# EAGLE design tiny-usb (EAGLE 5.10)
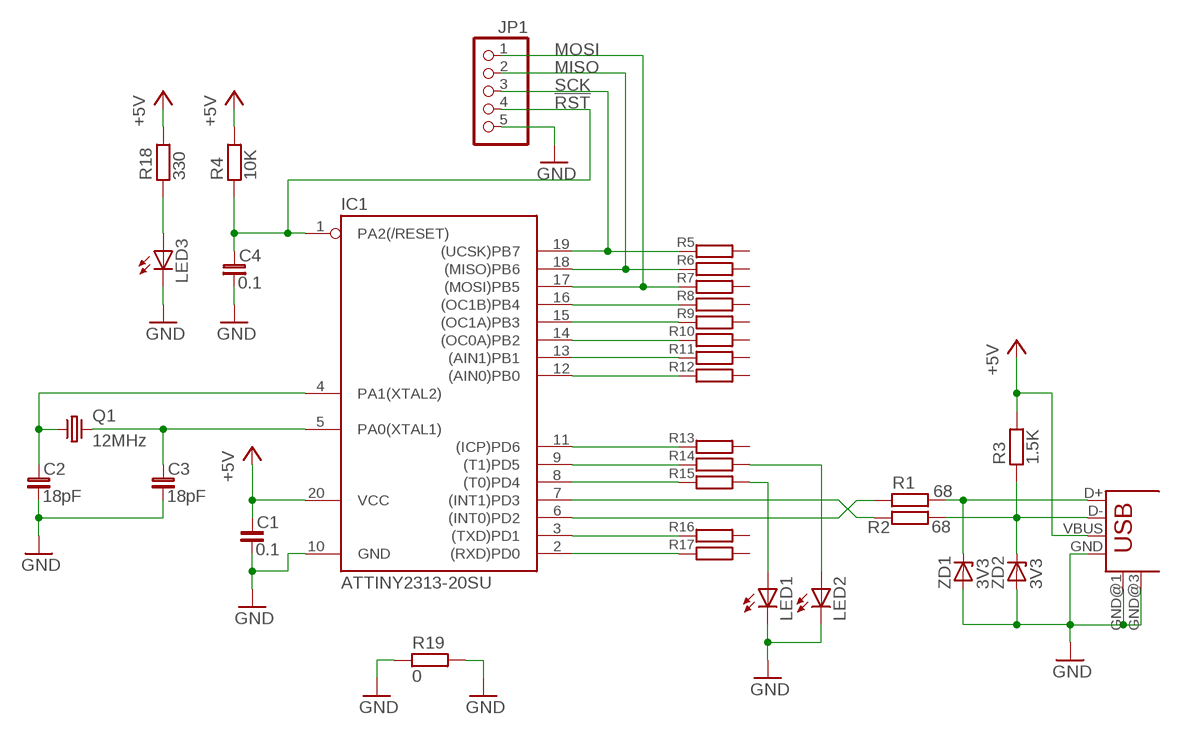
[diagram p0: schematic, sheet 1]

## Parts
C1  0.1  C_0603  [C0603]
C2  18pF  C_0603  [C0603]
C3  18pF  C_0603  [C0603]
C4  0.1  C_0603  [C0603]
IC1  ATTINY2313-20SU  TINY2313-*S*  [SO20L$]
JP1  PINHD-1X5_2.00  [1X05M]
LED1  LEDCHIP-LED0603  [CHIP-LED0603]
LED2  LEDCHIP-LED0603  [CHIP-LED0603]
LED3  LEDCHIP-LED0603  [CHIP-LED0603]
Q1  12MHz  CRYSTAL-HC49S  [HC49/S]
R1  68  R_0603  [R0603]
R2  68  R_0603  [R0603]
R3  1.5K  R_0603  [R0603]
R4  10K  R_0603  [R0603]
R5  220  R_0603  [R0603]
R6  220  R_0603  [R0603]
R7  220  R_0603  [R0603]
R8  220  R_0603  [R0603]
R9  220  R_0603  [R0603]
R10  220  R_0603  [R0603]
R11  220  R_0603  [R0603]
R12  220  R_0603  [R0603]
R13  220  R_0603  [R0603]
R14  220  R_0603  [R0603]
R15  220  R_0603  [R0603]
R16  220  R_0603  [R0603]
R17  220  R_0603  [R0603]
R18  330  R_0603  [R0603]
R19  0  R_1206  [R1206]
USB1  USB-MB-S  [USB-MB-S]
ZD1  3V3  ZD-SOD-80  [SOD80]
ZD2  3V3  ZD-SOD-80  [SOD80]

## Nets
!RST: C4.1 IC1.1(PA2(/RESET)) JP1.4 R4.1
+5V: C1.1 IC1.20(VCC) R3.2 R4.2 R18.2 USB1.VBUS
GND: C1.2 C2.2 C3.2 C4.2 IC1.10(GND) JP1.5 LED1.C LED2.C LED3.C R19.1 R19.2 USB1.GND USB1.GND@1(GND) USB1.GND@3(GND) ZD1.A ZD2.A
MISO: IC1.18((MISO)PB6) JP1.2 R6.1
MOSI: IC1.17((MOSI)PB5) JP1.1 R7.1
N$1: R2.2 R3.1 USB1.D- ZD2.C
N$2: R1.2 USB1.D+ ZD1.C
N$3: IC1.6((INT0)PD2) R1.1
N$4: IC1.7((INT1)PD3) R2.1
N$5: C3.1 IC1.5(PA0(XTAL1)) Q1.2
N$6: C2.1 IC1.4(PA1(XTAL2)) Q1.1
N$7: IC1.16((OC1B)PB4) R8.1
N$8: IC1.15((OC1A)PB3) R9.1
N$9: IC1.14((OC0A)PB2) R10.1
N$10: IC1.13((AIN1)PB1) R11.1
N$11: IC1.12((AIN0)PB0) R12.1
N$12: IC1.11((ICP)PD6) R13.1
N$13: IC1.9((T1)PD5) R14.1
N$14: IC1.8((T0)PD4) R15.1
N$15: IC1.3((TXD)PD1) R16.1
N$16: IC1.2((RXD)PD0) R17.1
N$17: LED1.A R15.2
N$18: LED2.A R14.2
N$19: LED3.A R18.1
SCK: IC1.19((UCSK)PB7) JP1.3 R5.1
Unconnected: R5.2 R6.2 R7.2 R8.2 R9.2 R10.2 R11.2 R12.2 R13.2 R16.2 R17.2

## Library data of the parts
C1-C4 = rc-master-smd:C_: NON-POLARIZED CAP
IC1 = avr-6:TINY2313*: Atmel Tiny2313 2K Flash, 128 bytes EEPROM, 128 bytes RAM
JP1 = pinhead-fixdrills:PINHD-1X5: PIN HEADER
LED1-LED3 = led:LED: LED OSRAM: - CHIPLED LG R971, LG N971, LY N971, LG Q971, LY Q971, LO R971, LY R971 LH N974, LH R974 LS Q976, LO Q976, LY Q976 LO Q996 - Hyper CHIPLED LW Q18S LB Q993, LB Q99A, LB R99A - SideLED LS A670, LO A670, LY A670, LG A670, LP A670 LB A673, LV A673, LT A673, LW A673 LH A674 LY A675 LS A676, LA A676, LO A676, LY A676, LW A676 LS A679, LY A679, LG A679 - Hyper Micro SIDELED® LS Y876, LA Y876, LO Y876, LY Y876 LT Y87S - SmartLED LW L88C, LW L88S LB L89C, LB L89S, LG L890 LS L89K, LO L89K, LY L89K LS L896, LA L896, LO L896, LY L896 - TOPLED LS T670, LO T670, LY T670, LG T670, LP T670 LSG T670, LSP T670, LSY T670, LOP T670, LYG T670 LG T671, LOG T671, LSG T671 LB T673, LV T673, LT T673, LW T673 LH T674 LS T676, LA T676, LO T676, LY T676, LB T676, LH T676, LSB T676, LW T676 LB T67C, LV T67C, LT T67C, LS T67K, LO T67K, LY T67K, LW E67C LS E67B, LA E67B, LO E67B, LY E67B, LB E67C, LV E67C, LT E67C LW T67C LS T679, LY T679, LG T679 LS T770, LO T770, LY T770, LG T770, LP T770 LB T773, LV T773, LT T773, LW T773 LH T774 LS E675, LA E675, LY E675, LS T675 LS T776, LA T776, LO T776, LY T776, LB T776 LHGB T686 LT T68C, LB T68C - Hyper Mini TOPLED® LB M676 - Mini TOPLED Santana® LG M470 LS M47K, LO M47K, LY M47K Source: http://www.osram.convergy.de - LUMILED® LXK2-PW12-R00, LXK2-PW12-S00, LXK2-PW14-U00, LXK2-PW14-V00 LXK2-PM12-R00, LXK2-PM12-S00, LXK2-PM14-U00 LXK2-PE12-Q00, LXK2-PE12-R00, LXK2-PE12-S00, LXK2-PE14-T00, LXK2-PE14-U00 LXK2-PB12-K00, LXK2-PB12-L00, LXK2-PB12-M00, LXK2-PB14-N00, LXK2-PB14-P00, LXK2-PB14-Q00 LXK2-PR12-L00, LXK2-PR12-M00, LXK2-PR14-Q00, LXK2-PR14-R00 LXK2-PD12-Q00, LXK2-PD12-R00, LXK2-PD12-S00 LXK2-PH12-R00, LXK2-PH12-S00 LXK2-PL12-P00, LXK2-PL12-Q00, LXK2-PL12-R00 Source: www.luxeon.com
Q1 = crystal:CRYSTAL-: CRYSTAL
R1-R19 = rc-master-smd:R_: RESISTOR
USB1 = usb:USB: USB Connectors
ZD1 ZD2 = diodes:ZD-: Zener diode

## Board
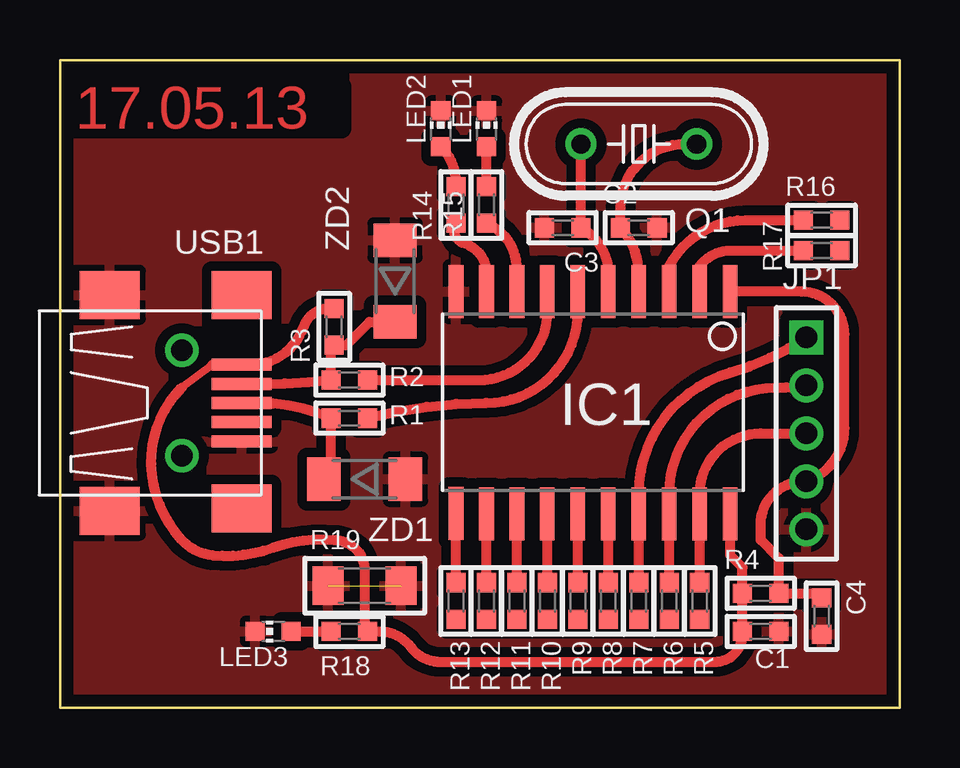
[diagram p1: board, top side]

Size 35 x 27 mm. Coordinates in mm from the lower left corner, seen from the top.
Outline: 0,0 35,0 35,27 0,27 0,0
Copper layers (1*16): Top 0.035mm / dielectric 1.5mm / Bottom 0.035mm
Design rules "default *": minimum track width 10mil, minimum drill 24mil, track to track 8mil, track to pad 8mil, pad to pad 8mil, via to via 8mil, smd to smd 8mil, copper to edge 0.5mm, drill to drill 8mil, minimum pad ring 10mil, minimum via ring 8mil, stop-mask expansion 4mil, vias tented up to drill 0mil, thermal gap 10mil

### Footprints (pad centres in the part's own frame; a part is rotated, then mirrored left to right if it is on the bottom)
C0603 = smd 0.8 x 0.8: 1 -0.762,0; 2 0.762,0
SO20L$ = smd 0.61 x 2.21: 1 -5.715,-4.636; 2 -4.445,-4.636; 3 -3.175,-4.636; 4 -1.905,-4.636; 5 -0.635,-4.636; 6 0.635,-4.636; 7 1.905,-4.636; 8 3.175,-4.636; 9 4.445,-4.636; 10 5.715,-4.636; 11 5.715,4.61; 12 4.445,4.636; 13 3.175,4.636; 14 1.905,4.636; 15 0.635,4.636; 16 -0.635,4.636; 17 -1.905,4.636; 18 -3.175,4.636; 19 -4.445,4.636; 20 -5.715,4.636
1X05M = drill 0.9 square: 1 -4,0 | drill 0.9 round: 2 -2,0; 3 0,0; 4 2,0; 5 4,0
CHIP-LED0603 = smd 0.8 x 0.8: A 0,-0.75; C 0,0.75
HC49/S = drill 0.8 round: 1 -2.413,0; 2 2.413,0
R0603 = smd 0.8 x 0.8: 1 -0.762,0; 2 0.762,0
R1206 = smd 1.3 x 1.6: 1 -1.524,0; 2 1.524,0
USB-MB-S = smd 2.5 x 0.5: D+ 2.5,0; D- 2.5,0.8; GND 2.5,-1.6; ID 2.5,-0.8; VBUS 2.5,1.6 | smd 2.5 x 2: GND@1 -3,4.5; GND@2 2.5,4.5; GND@3 -3,-4.5; GND@4 2.5,-4.4 | drill 0.9 round: P$5 0,2.2; P$6 0,-2.2
SOD80 = smd 1.4 x 1.8: A 1.7,0; C -1.7,0

### Placement (x,y rotation side)
C1  29.21,3.17 0 top
C2  24.13,20 0 top
C3  20.95,20 180 top
C4  31.75,3.81 270 top
IC1  22.23,12.7 180 top
JP1  31.11,11.43 270 top
LED1  17.78,24.13 0 top
LED2  15.88,24.13 0 top
LED3  8.89,3.17 90 top
Q1  24.13,23.5 180 top
R1  12.06,12.06 180 top
R2  12.06,13.65 180 top
R3  11.43,15.88 90 top
R4  29.21,4.76 180 top
R5  26.67,4.45 270 top
R6  25.4,4.45 270 top
R7  24.13,4.45 270 top
R8  22.86,4.45 270 top
R9  21.59,4.45 270 top
R10  20.32,4.45 270 top
R11  19.05,4.45 270 top
R12  17.78,4.45 270 top
R13  16.51,4.45 270 top
R14  16.51,20.95 90 top
R15  17.78,20.95 90 top
R16  31.75,20.32 0 top
R17  31.75,19.05 0 top
R18  12.06,3.17 0 top
R19  12.7,5.08 0 top
USB1  5.08,12.7 0 top
ZD1  12.7,9.53 0 top
ZD2  13.97,17.78 90 top

### Tracks (layer width: path | path; a pad name or v marks a point on that pad's centre or on a via)
!RST
  Top 0.406: IC1.1 30.92,17.34 arc-90 32.7,15.56 32.7,11.65 arc-71 JP1.4 arc93 29.21,7.62 29.21,6.99 29.97,6.22 R4.1 31.56,4.76 C4.1
+5V
  Top 0.305: 5.08,13.34 6.36,14.3
  Top 0.406: IC1.20 27.94,6.35 28.45,5.84 R4.2 C1.1 arc-96 27.3,1.91 15.88,1.91 arc-53 14.61,2.54 arc53 13.34,3.17 R18.2 12.7,3.3 12.7,5.71 arc90 11.43,6.99 arc25 8.89,6.67 arc-25 6.35,6.35 arc-42 5.08,6.99 arc-41 3.81,10.16 arc-46 5.08,13.34 | 6.36,14.3 USB1.VBUS 7.95,14.3 arc71 10.16,15.88 arc-80 R3.2
GND  (1 unrouted)
  pour Top (isolate 0.406): 0,27.3 34.29,27.3 34.29,0 0,0
MISO
  Top 0.406: R6.1 IC1.18 25.4,8.89 arc-90 29.84,13.34 arc9 JP1.2
MOSI
  Top 0.406: R7.1 IC1.17 24.13,8.89 arc-74 27.94,13.97 arc17 JP1.1
N$1
  Top 0.406: USB1.D- 8.42,13.5 arc6 R2.2 11.3,14.99 R3.1 11.94,15.11 12.9,16.08 ZD2.C
N$2
  Top 0.406: USB1.D+ 8.26,12.7 arc-24 R1.2 11.3,9.83 ZD1.C
N$3
  Top 0.406: IC1.6 21.59,16.51 arc-90 17.78,12.7 arc15 R1.1
N$4
  Top 0.406: R2.1 17.46,13.65 arc90 20.32,16.51 IC1.7
N$5
  Top 0.406: IC1.5 22.86,18.1 arc62 C3.1 | C3.1 21.72,19.88 | C3.1 Q1.2
N$6
  Top 0.406: IC1.4 24.13,18.1 arc44 C2.1 23.37,20.83 arc-90 26.04,23.5 Q1.1
N$7
  Top 0.406: R8.1 IC1.16
N$8
  Top 0.406: R9.1 IC1.15
N$9
  Top 0.406: R10.1 IC1.14
N$10
  Top 0.406: R11.1 IC1.13
N$11
  Top 0.406: R12.1 IC1.12
N$12
  Top 0.406: R13.1 IC1.11
N$13
  Top 0.406: IC1.9 17.78,18.1 arc74 16.83,19.37 arc-105 R14.1
N$14
  Top 0.406: IC1.8 19.05,18.29 arc67 R15.1
N$15
  Top 0.406: IC1.3 25.4,18.41 arc-62 28.57,20.32 R16.1
N$16
  Top 0.406: IC1.2 26.67,18.41 arc-53 27.94,19.05 R17.1
N$17
  Top 0.406: R15.2 LED1.A
N$18
  Top 0.406: R14.2 16.51,21.91 arc47 LED2.A
N$19
  Top 0.406: LED3.A R18.1
SCK
  Top 0.406: R5.1 IC1.19 26.67,8.89 arc-90 29.21,11.43 JP1.3

### Text on the board
Top: 17.05.13